# EasyEDA Pro project ProPrj_嵌赛国赛_2025-08-15.epro, board PCB5
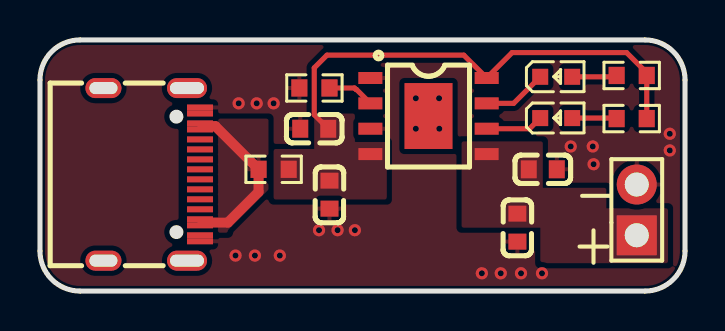
[diagram p14: board, top side]
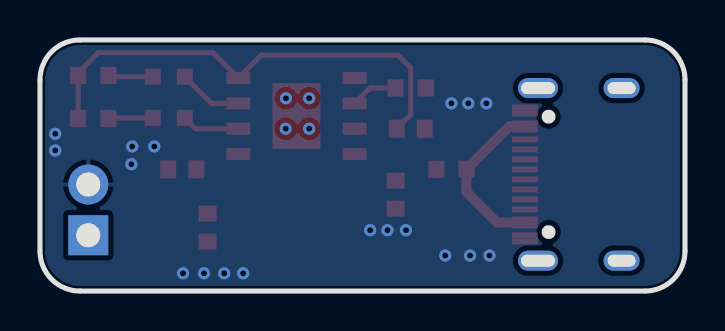
[diagram p15: board, bottom side, seen from below]

Outline 32.26 x 12.57 mm; copper layers: Top Layer, Bottom Layer. Coordinates in mm from the lower left corner of the outline.
Outline path: 0,10.57 0,2 arc(0.59,0.59) 2,0 30.26,0 arc(31.67,0.59) 32.26,2 32.26,10.57 arc(31.67,11.99) 30.26,12.57 2,12.57 arc(0.59,11.99) 0,10.57
Stack: Top Layer 0.035mm / Dielectric1 1.51mm FR4 er 4.5 / Bottom Layer 0.035mm

## Design rules (mm)
template: 自定义配置
spacing copperThickness1oz (default): track to track 0.102, other pairs 0.152 to 0.3
spacing copperThickness2oz: track to track 0.203, other pairs 0.152 to 0.3
track width copperThickness1oz (default): min 0.127, default 0.254, max 2.54
track width copperThickness2oz: min 0.203, default 0.254, max 2.54
differential pair differentialPair (default): width min 0.127, default 0.254, max 2.54; gap min 0.152, default 0.152
via viaSize (default): diameter min 0.5, default 0.61, max 10; hole min 0.3, default 0.305, max 6.3
net $1N551 uses 123123
net BAT+ uses 123123

## Placement (name value [footprint] x y rotation side)
C1  100nF  [C0603]  14.48 4.83 90 top
C2  10uF  [C0603]  13.72 8.13 0 top
C3  100nF  [C0603]  23.88 3.17 90 top
C4  10uF  [C0603]  25.15 6.1 180 top
H1  PZ254V-11-02P  [HDR-TH_2P-P2.54-V-M]  29.84 4.06 90 top
LED1  LTST-C190KSKT  [LED0603-RD]  25.82 8.66 0 top
LED2  LTST-C190KSKT  [LED0603-RD]  25.82 10.73 0 top
R1  250mΩ  [R0603]  11.68 6.1 0 top
R2  2kΩ  [R0603]  29.59 10.8 0 top
R3  10kΩ  [R0603]  29.59 8.64 0 top
R4  1.2kΩ  [R0603]  13.72 10.17 0 top
U1  TP4056  [ESOP-8_L4.9-W3.9-P1.27-LS6.0-BL-EP]  19.43 8.76 270 top
USB1  KH-TYPE-C-16P  [usb-c-smd_kh-type-c-16p]  5.59 5.84 270 top

## Footprints (pads in the part's own frame, mm; a bottom-side part is the same pattern mirrored in y, then rotated)
C0603
  rect 0.8x0.9 smd: 1(-0.7,0) 2(0.7,0)
ESOP-8_L4.9-W3.9-P1.27-LS6.0-BL-EP
  rect 0.6x1.2 smd: 1(-1.905,-2.909) 2(-0.635,-2.909) 3(0.635,-2.909) 4(1.905,-2.909) 5(1.905,2.909) 6(0.635,2.909) 7(-0.635,2.909) 8(-1.905,2.909)
  rect 3.3x2.4 smd: 9(0,0)
HDR-TH_2P-P2.54-V-M
  rect 2x2 hole 1.2: 1(-1.27,0)
  round 2 hole 1.2: 2(1.27,0)
LED0603-RD
  rect 0.8x0.8 smd: 1(-0.799,0) 2(0.799,0)
R0603
  rect 0.806x0.864 smd: 1(-0.753,0) 2(0.753,0)
usb-c-smd_kh-type-c-16p
  oval 1x2 hole 0.6x1.7: 1(-4.32,1.765) 2(4.32,1.765)
  oval 1x1.8 hole 0.6x1.4: 3(-4.32,-2.415) 4(4.32,-2.415)
  rect 0.3x1.3 smd: A1(-3.35,2.415) A4(-2.55,2.415) A5(-1.25,2.415) A6(-0.25,2.415) A7(0.25,2.415) A8(1.25,2.415) A9(2.55,2.415) A12(3.35,2.415) B1(3.05,2.415) B4(2.25,2.415) B5(1.75,2.415) B6(0.75,2.415) B7(-0.75,2.415) B8(-1.75,2.415) B9(-2.25,2.415) B12(-3.05,2.415)

## Nets
As in the schematic.

Pads without a net: U1 9; USB1 1 2 3 4 A5 A6 A7 A8 B5 B6 B7 B8

## Via types
v1: diameter 0.61, hole 0.305, Top Layer to Bottom Layer, 22 vias

## Routing (per net, layer and track width the routed paths; a pad name or vN(x,y) marks a point on that pad's centre or on a via; arc(x,y) is an arc through that point)
5V: length 8.5
  Top Layer w0.254: USB1.A4 USB1.B9
  Top Layer w0.5: 8.14,3.43 9.4,3.43 10.93,4.96 R1.1 8.77,8.25 8.17,8.25
GND:
  vias: v1(9.78,1.78) v1(9.94,9.4) v1(10.75,1.78) v1(10.84,9.4) v1(11.68,9.4) v1(11.99,1.78) v1(13.95,3.05) v1(14.88,3.05) v1(15.75,3.05) v1(22.1,0.89) v1(23.04,0.89) v1(24.06,0.89) v1(25.1,0.89) v1(26.54,7.24) v1(27.65,7.24) v1(27.69,6.35) v1(31.5,7.87) v1(31.5,7.04)
(no net):
  vias: v1(18.8,9.65) v1(18.8,8.13) v1(19.96,9.65) v1(19.97,8.13)
$1N551: length 23.9
  Top Layer w0.254: R3.2 R2.2 30.34,10.93 29.34,11.94 23.61,11.94 U1.8 21.2,11.81 14.35,11.81 13.72,11.18 13.72,8.83 C2.2
$1N833: length 3.2
  Top Layer w0.254: U1.7 23.69,9.4 LED2.1
$1N837: length 2.9
  Top Layer w0.254: LED1.1 24.49,8.13 U1.6
$1N842: length 2.2
  Top Layer w0.254: R2.1 28.77,10.73 LED2.2
$1N846: length 2.2
  Top Layer w0.254: LED1.2 28.81,8.66 R3.1
$1N1003: length 2.4
  Top Layer w0.254: R4.2 15.73,10.17 15.81,10.09 15.83,10.09 U1.2

## Copper pours and planes (outline as drawn; the poured copper is in the pictures)
5V on Top Layer: 7.24,8.64 11.43,8.64 11.43,5.08 9.4,3.05 9.4,2.92 7.19,2.92 7.19,8.59
GND on Top Layer: -6.1,14.35 40,14.35 40.89,13.46 40.89,3.3 35.69,-1.91 -3.43,-1.91 -6.1,0.76
GND on Bottom Layer: -3.3,16.26 39.5,16.26 41.53,14.22 41.53,0 38.74,-2.79 -3.94,-2.79 -3.94,15.62
BAT+ on Top Layer: 21.08,7.49 25.15,7.49 25.15,5.17 28.32,5.17 28.32,4.14 31.41,4.14 31.41,1.4 25.02,1.4 25.02,3.17 21.08,3.17
$1N551 on Top Layer: 11.68,7.11 11.68,4.59 17.34,4.59 17.34,7.47 15.78,7.47 15.75,7.49 15.75,8.89 13.72,8.89 13.72,7.12 13.71,7.11

## Text on the board
Top Silkscreen Layer: + | -
